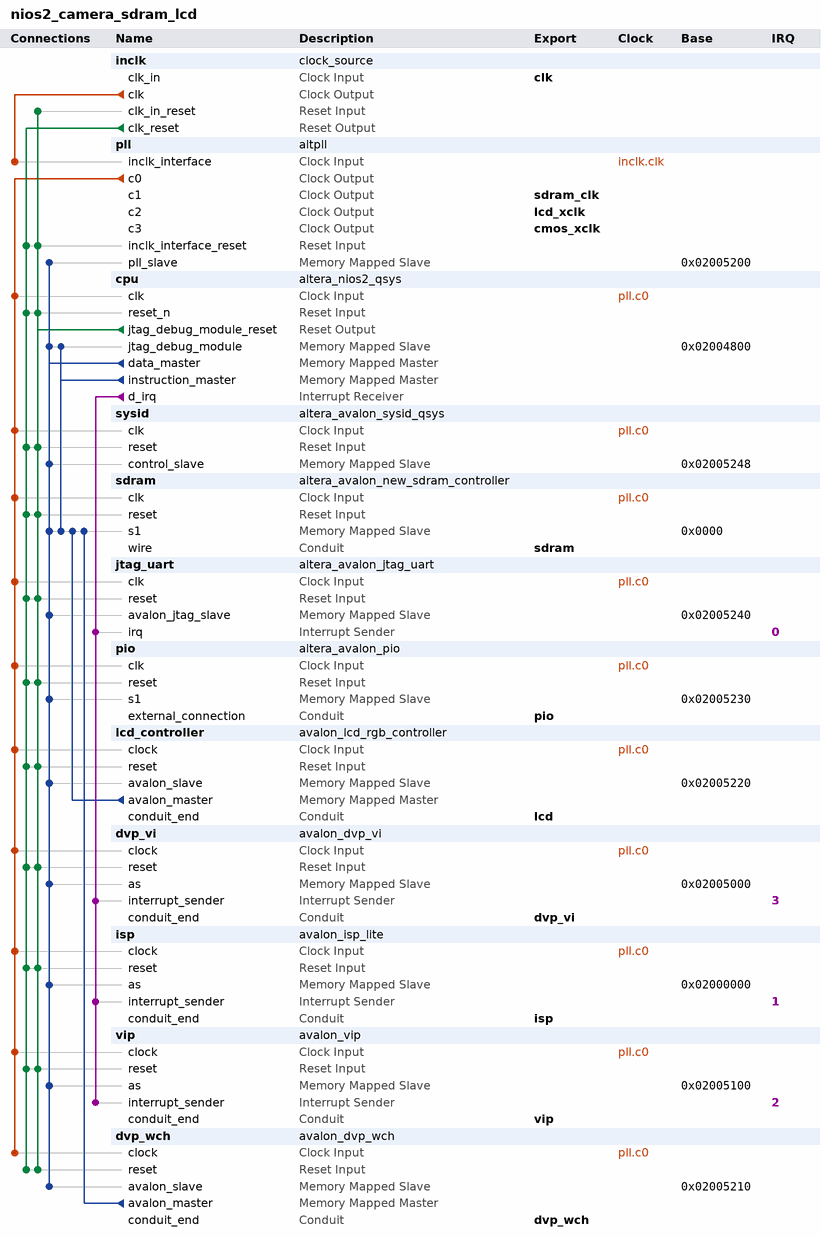
[diagram p0: system contents]
# Platform Designer (Qsys) system nios2_camera_sdram_lcd, Cyclone IV E EP4CE6F17C8
# Parameters at their usual value, and those the tool derives, are not listed.
package require -exact qsys 12.1
create_system nios2_camera_sdram_lcd
set_project_property DEVICE_FAMILY {Cyclone IV E}
set_project_property DEVICE EP4CE6F17C8

add_instance inclk clock_source 12.1
set_instance_parameter_value inclk clockFrequency 50000000

add_instance pll altpll 12.1
set_instance_parameter_value pll INCLK0_INPUT_FREQUENCY 20000
set_instance_parameter_value pll CLK0_MULTIPLY_BY 2
set_instance_parameter_value pll CLK1_MULTIPLY_BY 2
set_instance_parameter_value pll CLK2_MULTIPLY_BY 9
set_instance_parameter_value pll CLK3_MULTIPLY_BY 1
set_instance_parameter_value pll CLK0_DIVIDE_BY 1
set_instance_parameter_value pll CLK1_DIVIDE_BY 1
set_instance_parameter_value pll CLK2_DIVIDE_BY 100
set_instance_parameter_value pll CLK3_DIVIDE_BY 1
set_instance_parameter_value pll CLK1_PHASE_SHIFT -2056
set_instance_parameter_value pll CLK2_PHASE_SHIFT 0
set_instance_parameter_value pll CLK3_PHASE_SHIFT 0
set_instance_parameter_value pll CLK1_DUTY_CYCLE 50
set_instance_parameter_value pll CLK2_DUTY_CYCLE 50
set_instance_parameter_value pll CLK3_DUTY_CYCLE 50
set_instance_parameter_value pll PORT_clk1 PORT_USED
set_instance_parameter_value pll PORT_clk2 PORT_USED
set_instance_parameter_value pll PORT_clk3 PORT_USED
set_instance_parameter_value pll PORT_ARESET PORT_UNUSED
set_instance_parameter_value pll PORT_LOCKED PORT_UNUSED

add_instance cpu altera_nios2_qsys 12.1
set_instance_parameter_value cpu resetSlave sdram.s1
set_instance_parameter_value cpu exceptionSlave sdram.s1
set_instance_parameter_value cpu breakSlave cpu.jtag_debug_module
set_instance_parameter_value cpu impl Tiny
set_instance_parameter_value cpu icache_size 4096

add_instance sysid altera_avalon_sysid_qsys 12.1
set_instance_parameter_value sysid id 0

add_instance sdram altera_avalon_new_sdram_controller 12.1
set_instance_parameter_value sdram TAC 5.4
set_instance_parameter_value sdram TRCD 20.0
set_instance_parameter_value sdram TRP 20.0
set_instance_parameter_value sdram TWR 20.0
set_instance_parameter_value sdram casLatency 3
set_instance_parameter_value sdram columnWidth 9
set_instance_parameter_value sdram dataWidth 16
set_instance_parameter_value sdram generateSimulationModel false
set_instance_parameter_value sdram initRefreshCommands 8
set_instance_parameter_value sdram model custom
set_instance_parameter_value sdram numberOfBanks 4
set_instance_parameter_value sdram numberOfChipSelects 1
set_instance_parameter_value sdram powerUpDelay 200.0
set_instance_parameter_value sdram refreshPeriod 7.8125
set_instance_parameter_value sdram rowWidth 13

add_instance jtag_uart altera_avalon_jtag_uart 12.1
set_instance_parameter_value jtag_uart simInteractiveOptions INTERACTIVE_ASCII_OUTPUT

add_instance pio altera_avalon_pio 12.1
set_instance_parameter_value pio direction Bidir
set_instance_parameter_value pio width 8

add_instance lcd_controller avalon_lcd_rgb_controller 1.0
set_instance_parameter_value lcd_controller H_FRONT 2
set_instance_parameter_value lcd_controller H_PULSE 41
set_instance_parameter_value lcd_controller H_BACK 2
set_instance_parameter_value lcd_controller H_DISP 480
set_instance_parameter_value lcd_controller V_FRONT 2
set_instance_parameter_value lcd_controller V_PULSE 10
set_instance_parameter_value lcd_controller V_BACK 2
set_instance_parameter_value lcd_controller V_DISP 272
set_instance_parameter_value lcd_controller H_POL 0
set_instance_parameter_value lcd_controller V_POL 0
set_instance_parameter_value lcd_controller AM_DATA_WIDTH 16
set_instance_parameter_value lcd_controller AM_MAXIMUM_BURST_COUNT 4
set_instance_parameter_value lcd_controller AM_BURST_COUNT_WIDTH 3
set_instance_parameter_value lcd_controller AM_ADDRESS_WIDTH 32
set_instance_parameter_value lcd_controller AM_FIFO_DEPTH 1024
set_instance_parameter_value lcd_controller AM_FIFO_DEPTH_LOG2 10
set_instance_parameter_value lcd_controller AM_MEMORY_BASED_FIFO 1

add_instance dvp_vi avalon_dvp_vi 1.0
set_instance_parameter_value dvp_vi BITS 8
set_instance_parameter_value dvp_vi COLORBAR_H_FRONT 200
set_instance_parameter_value dvp_vi COLORBAR_H_PULSE 536
set_instance_parameter_value dvp_vi COLORBAR_H_BACK 200
set_instance_parameter_value dvp_vi COLORBAR_H_DISP 960
set_instance_parameter_value dvp_vi COLORBAR_V_FRONT 100
set_instance_parameter_value dvp_vi COLORBAR_V_PULSE 240
set_instance_parameter_value dvp_vi COLORBAR_V_BACK 100
set_instance_parameter_value dvp_vi COLORBAR_V_DISP 544
set_instance_parameter_value dvp_vi COLORBAR_BAYER 0

add_instance isp avalon_isp_lite 1.0
set_instance_parameter_value isp BITS 8
set_instance_parameter_value isp WIDTH 960
set_instance_parameter_value isp HEIGHT 544
set_instance_parameter_value isp BAYER 0
set_instance_parameter_value isp STAT_BITS 28

add_instance vip avalon_vip 1.0
set_instance_parameter_value vip BITS 8
set_instance_parameter_value vip WIDTH 960
set_instance_parameter_value vip HEIGHT 544

add_instance dvp_wch avalon_dvp_wch 1.0
set_instance_parameter_value dvp_wch AM_DATA_WIDTH 16
set_instance_parameter_value dvp_wch AM_MAX_BURST_COUNT 4
set_instance_parameter_value dvp_wch AM_BURST_COUNT_WIDTH 3
set_instance_parameter_value dvp_wch AM_ADDRESS_WIDTH 32
set_instance_parameter_value dvp_wch AM_FIFO_DEPTH 1024
set_instance_parameter_value dvp_wch AM_FIFO_DEPTH_LOG2 10
set_instance_parameter_value dvp_wch AM_MEMORY_BASED_FIFO 1

# connections
add_connection inclk.clk pll.inclk_interface clock
add_connection pll.c0 cpu.clk clock
add_connection pll.c0 dvp_vi.clock clock
add_connection pll.c0 dvp_wch.clock clock
add_connection pll.c0 isp.clock clock
add_connection pll.c0 jtag_uart.clk clock
add_connection pll.c0 lcd_controller.clock clock
add_connection pll.c0 pio.clk clock
add_connection pll.c0 sdram.clk clock
add_connection pll.c0 sysid.clk clock
add_connection pll.c0 vip.clock clock
add_connection cpu.jtag_debug_module_reset cpu.reset_n reset
add_connection cpu.jtag_debug_module_reset dvp_vi.reset reset
add_connection cpu.jtag_debug_module_reset dvp_wch.reset reset
add_connection cpu.jtag_debug_module_reset inclk.clk_in_reset reset
add_connection cpu.jtag_debug_module_reset isp.reset reset
add_connection cpu.jtag_debug_module_reset jtag_uart.reset reset
add_connection cpu.jtag_debug_module_reset lcd_controller.reset reset
add_connection cpu.jtag_debug_module_reset pio.reset reset
add_connection cpu.jtag_debug_module_reset pll.inclk_interface_reset reset
add_connection cpu.jtag_debug_module_reset sdram.reset reset
add_connection cpu.jtag_debug_module_reset sysid.reset reset
add_connection cpu.jtag_debug_module_reset vip.reset reset
add_connection inclk.clk_reset cpu.reset_n reset
add_connection inclk.clk_reset dvp_vi.reset reset
add_connection inclk.clk_reset dvp_wch.reset reset
add_connection inclk.clk_reset isp.reset reset
add_connection inclk.clk_reset jtag_uart.reset reset
add_connection inclk.clk_reset lcd_controller.reset reset
add_connection inclk.clk_reset pio.reset reset
add_connection inclk.clk_reset pll.inclk_interface_reset reset
add_connection inclk.clk_reset sdram.reset reset
add_connection inclk.clk_reset sysid.reset reset
add_connection inclk.clk_reset vip.reset reset
add_connection cpu.data_master cpu.jtag_debug_module avalon
set_connection_parameter_value cpu.data_master/cpu.jtag_debug_module baseAddress 0x02004800
add_connection cpu.data_master dvp_vi.as avalon
set_connection_parameter_value cpu.data_master/dvp_vi.as baseAddress 0x02005000
add_connection cpu.data_master dvp_wch.avalon_slave avalon
set_connection_parameter_value cpu.data_master/dvp_wch.avalon_slave baseAddress 0x02005210
add_connection cpu.data_master isp.as avalon
set_connection_parameter_value cpu.data_master/isp.as baseAddress 0x02000000
add_connection cpu.data_master jtag_uart.avalon_jtag_slave avalon
set_connection_parameter_value cpu.data_master/jtag_uart.avalon_jtag_slave baseAddress 0x02005240
add_connection cpu.data_master lcd_controller.avalon_slave avalon
set_connection_parameter_value cpu.data_master/lcd_controller.avalon_slave baseAddress 0x02005220
add_connection cpu.data_master pio.s1 avalon
set_connection_parameter_value cpu.data_master/pio.s1 baseAddress 0x02005230
add_connection cpu.data_master pll.pll_slave avalon
set_connection_parameter_value cpu.data_master/pll.pll_slave baseAddress 0x02005200
add_connection cpu.data_master sdram.s1 avalon
set_connection_parameter_value cpu.data_master/sdram.s1 baseAddress 0x0000
add_connection cpu.data_master sysid.control_slave avalon
set_connection_parameter_value cpu.data_master/sysid.control_slave baseAddress 0x02005248
add_connection cpu.data_master vip.as avalon
set_connection_parameter_value cpu.data_master/vip.as baseAddress 0x02005100
add_connection cpu.instruction_master cpu.jtag_debug_module avalon
set_connection_parameter_value cpu.instruction_master/cpu.jtag_debug_module baseAddress 0x02004800
add_connection cpu.instruction_master sdram.s1 avalon
set_connection_parameter_value cpu.instruction_master/sdram.s1 baseAddress 0x0000
add_connection dvp_wch.avalon_master sdram.s1 avalon
set_connection_parameter_value dvp_wch.avalon_master/sdram.s1 baseAddress 0x0000
add_connection lcd_controller.avalon_master sdram.s1 avalon
set_connection_parameter_value lcd_controller.avalon_master/sdram.s1 baseAddress 0x0000
add_connection cpu.d_irq dvp_vi.interrupt_sender interrupt
set_connection_parameter_value cpu.d_irq/dvp_vi.interrupt_sender irqNumber 3
add_connection cpu.d_irq isp.interrupt_sender interrupt
set_connection_parameter_value cpu.d_irq/isp.interrupt_sender irqNumber 1
add_connection cpu.d_irq jtag_uart.irq interrupt
set_connection_parameter_value cpu.d_irq/jtag_uart.irq irqNumber 0
add_connection cpu.d_irq vip.interrupt_sender interrupt
set_connection_parameter_value cpu.d_irq/vip.interrupt_sender irqNumber 2

# exported interfaces
add_interface clk clock sink
set_interface_property clk EXPORT_OF inclk.clk_in
add_interface cmos_xclk clock source
set_interface_property cmos_xclk EXPORT_OF pll.c3
add_interface lcd_xclk clock source
set_interface_property lcd_xclk EXPORT_OF pll.c2
add_interface sdram_clk clock source
set_interface_property sdram_clk EXPORT_OF pll.c1
add_interface sdram conduit end
set_interface_property sdram EXPORT_OF sdram.wire
add_interface pio conduit end
set_interface_property pio EXPORT_OF pio.external_connection
add_interface lcd conduit end
set_interface_property lcd EXPORT_OF lcd_controller.conduit_end
add_interface isp conduit end
set_interface_property isp EXPORT_OF isp.conduit_end
add_interface vip conduit end
set_interface_property vip EXPORT_OF vip.conduit_end
add_interface dvp_wch conduit end
set_interface_property dvp_wch EXPORT_OF dvp_wch.conduit_end
add_interface dvp_vi conduit end
set_interface_property dvp_vi EXPORT_OF dvp_vi.conduit_end

save_system nios2_camera_sdram_lcd.qsys
